# EAGLE design Diseño  (EAGLE 6.4)
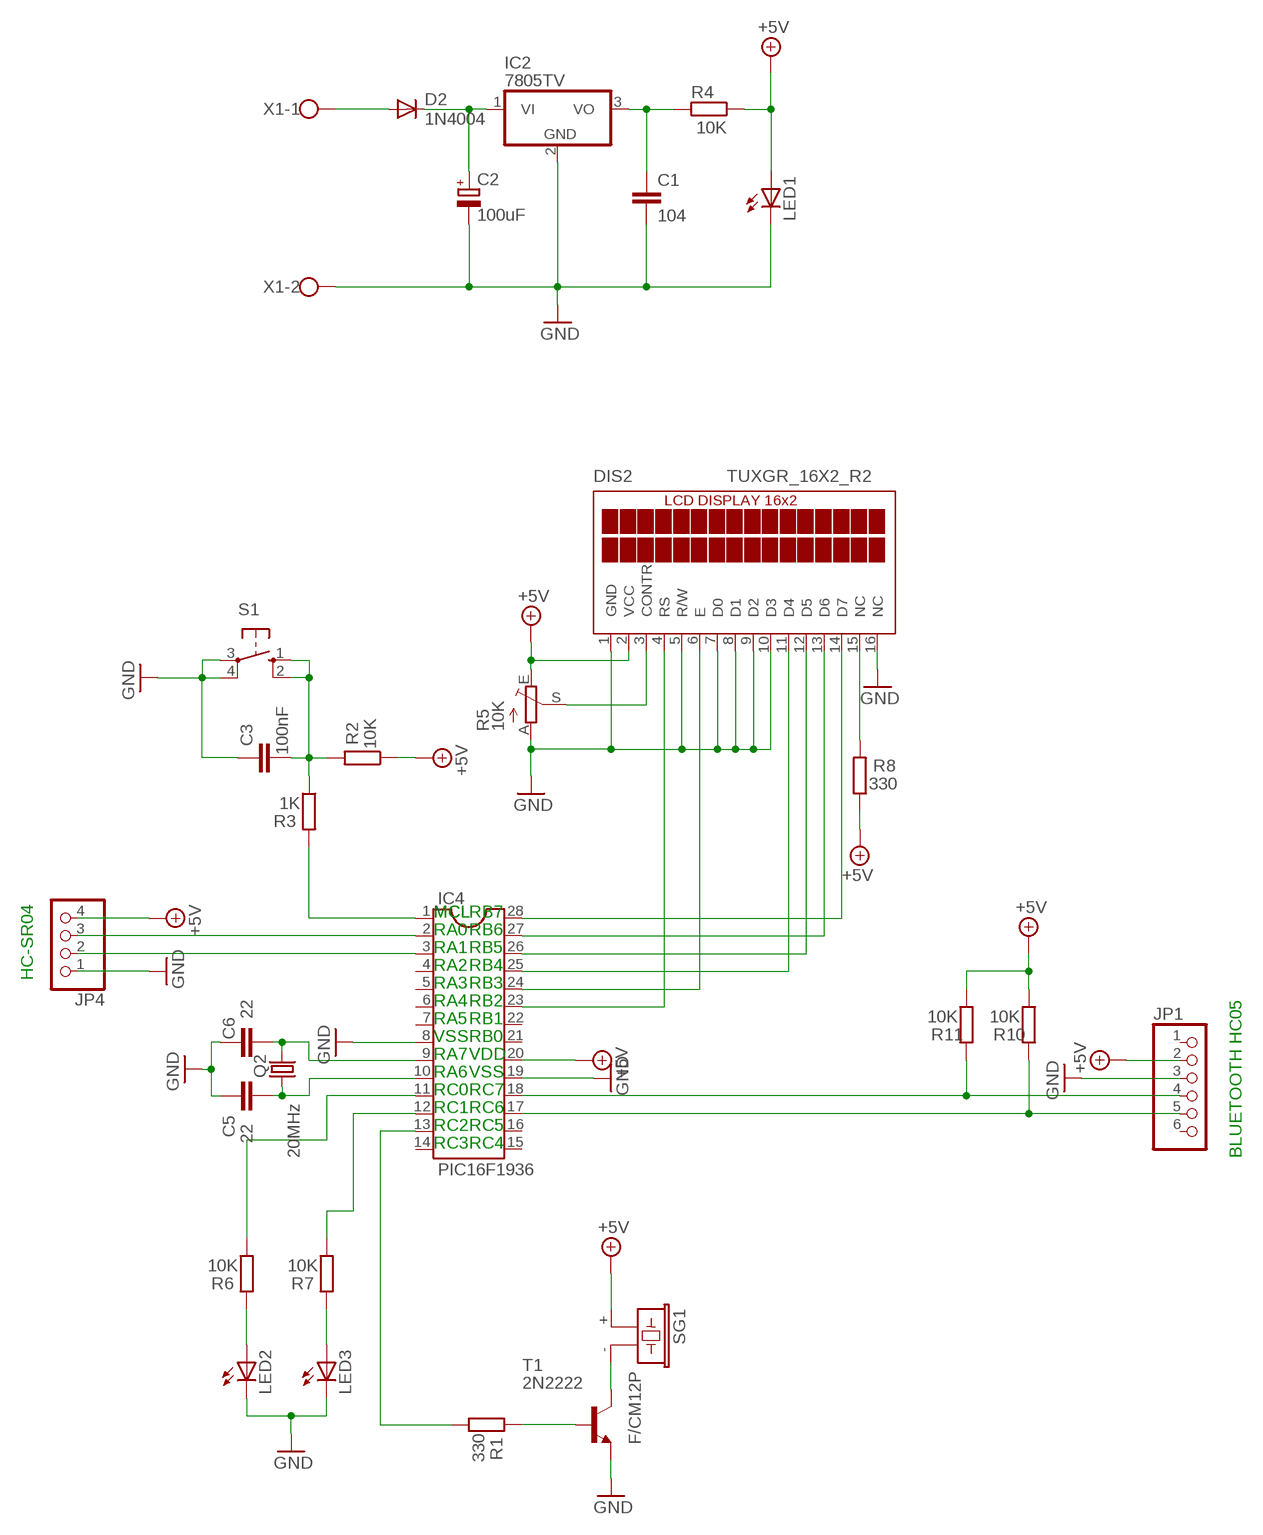
[diagram p0: schematic, sheet 1]

## Parts
C1  104  C-EU050-024X044  [C050-024X044]
C2  100uF  CPOL-EUE5-5  [E5-5]
C3  100nF  C-EU050-024X044  [C050-024X044]
C5  22  C-EU050-024X044  [C050-024X044]
C6  22  C-EU050-024X044  [C050-024X044]
D2  1N4004  [DO41-10]
DIS2  TUXGR_16X2_R2  [TUXGR_16X2_R2]
IC2  7805TV  [TO220V]
IC4  PIC16F1936  DIL28/3  [DIL28S]
JP1  PINHD-1X6  [1X06]
JP4  PINHD-1X4  [1X04]
LED1  LED3MM  [LED3MM]
LED2  LED3MM  [LED3MM]
LED3  LED3MM  [LED3MM]
Q2  20MHz  CRYSTALHC49U-V  [HC49U-V]
R1  330  R-EU_0207/10  [0207/10]
R2  10K  R-EU_0207/10  [0207/10]
R3  1K  R-EU_0207/10  [0207/10]
R4  10K  R-EU_0207/10  [0207/10]
R5  10K  TRIM_EU-CA9V  [CA9V]
R6  10K  R-EU_0207/10  [0207/10]
R7  10K  R-EU_0207/10  [0207/10]
R8  330  R-EU_0207/10  [0207/10]
R10  10K  R-EU_0207/10  [0207/10]
R11  10K  R-EU_0207/10  [0207/10]
S1  10-XX  [B3F-10XX]
SG1  F/CM12P  [F/CM12P]
T1  2N2222  2N2222-NPN-TO92-EBC  [TO92-EBC]
X1  W237-102  [W237-102]

## Nets
+5V: DIS2.2(VCC) IC4.20 JP1.2 JP4.4 LED1.A R2.1 R4.1 R5.E R8.1 R10.1 R11.1 SG1.+
GND: C1.2 C2.- C3.2 C5.2 C6.2 DIS2.1(GND) DIS2.5(R/W) DIS2.7(D0) DIS2.8(D1) DIS2.9(D2) DIS2.10(D3) DIS2.16(NC) IC2.2(GND) IC4.8 IC4.19 JP1.3 JP4.1 LED1.K(C) LED2.K(C) LED3.K(C) R5.A S1.3(P) S1.4(P1) T1.E X1.2
N$1: D2.A X1.1
N$2: IC4.1 R3.2
N$3: R1.2 T1.B
N$4: SG1.- T1.C
N$5: C3.1 R2.2 R3.1 S1.1(S) S1.2(S1)
N$6: IC4.13 R1.1
N$7: IC4.2 JP4.3
N$8: DIS2.15(NC) R8.2
N$9: IC4.18 JP1.4 R11.2
N$10: IC4.17 JP1.5 R10.2
N$11: DIS2.11(D4) IC4.25
N$12: DIS2.12(D5) IC4.26
N$13: IC4.3 JP4.2
N$14: LED2.A R6.2
N$15: DIS2.13(D6) IC4.27
N$16: DIS2.14(D7) IC4.28
N$17: DIS2.6(E) IC4.24
N$18: C5.1 IC4.10 Q2.1
N$19: C6.1 IC4.9 Q2.2
N$20: DIS2.4(RS) IC4.23
N$21: C2.+ D2.C IC2.1(VI)
N$22: C1.1 IC2.3(VO) R4.2
N$24: LED3.A R7.2
N$26: IC4.11 R6.1
N$27: IC4.12 R7.1
N$51: DIS2.3(CONTR) R5.S
Unconnected: IC4.4 IC4.5 IC4.6 IC4.7 IC4.14 IC4.15 IC4.16 IC4.21 IC4.22 JP1.1 JP1.6

## Notes on the sheet
- MCL | MCL | RB7
- RA0 | RB6
- RA1 | RB5
- RA2 | RB4
- HC-SR04
- RA3 | RB3
- RA4 | RB2
- RA5 | RB1
- VSS | RB0
- RA7 | VDD
- RA6 | VSS
- RC0 | RC7
- RC1 | RC6
- RC2 | RC5
- RC3 | RC4
- BLUETOOTH HC05

## Library data of the parts
C1 C3 C5 C6 = rcl:C-EU: CAPACITOR, European symbol
C2 = rcl:CPOL-EU: POLARIZED CAPACITOR, European symbol
D2 = diode:1N4004: DIODE general purpose rectifier, 1 A
DIS2 = display-lcd:TUXGR_16X2_R2: Tuxgraphics LCD display 16x2 characters reflective, without background light Source: tuxgr_12x2_r2.pdf
IC2 = linear:78*: Positive VOLTAGE REGULATOR Source: http://cache.national.com/ds/LM/LM78L05.pdf http://www.fairchildsemi.com/ds/LM/LM7805.pdf
IC4 = dil:DIL28: SOCKET DIL28
JP1 = pinhead:PINHD-1X6: PIN HEADER
JP4 = pinhead:PINHD-1X4: PIN HEADER
LED1-LED3 = led:LED: LED OSRAM: - CHIPLED LG R971, LG N971, LY N971, LG Q971, LY Q971, LO R971, LY R971 LH N974, LH R974 LS Q976, LO Q976, LY Q976 LO Q996 - Hyper CHIPLED LW Q18S LB Q993, LB Q99A, LB R99A - SideLED LS A670, LO A670, LY A670, LG A670, LP A670 LB A673, LV A673, LT A673, LW A673 LH A674 LY A675 LS A676, LA A676, LO A676, LY A676, LW A676 LS A679, LY A679, LG A679 - Hyper Micro SIDELED® LS Y876, LA Y876, LO Y876, LY Y876 LT Y87S - SmartLED LW L88C, LW L88S LB L89C, LB L89S, LG L890 LS L89K, LO L89K, LY L89K LS L896, LA L896, LO L896, LY L896 - TOPLED LS T670, LO T670, LY T670, LG T670, LP T670 LSG T670, LSP T670, LSY T670, LOP T670, LYG T670 LG T671, LOG T671, LSG T671 LB T673, LV T673, LT T673, LW T673 LH T674 LS T676, LA T676, LO T676, LY T676, LB T676, LH T676, LSB T676, LW T676 LB T67C, LV T67C, LT T67C, LS T67K, LO T67K, LY T67K, LW E67C LS E67B, LA E67B, LO E67B, LY E67B, LB E67C, LV E67C, LT E67C LW T67C LS T679, LY T679, LG T679 LS T770, LO T770, LY T770, LG T770, LP T770 LB T773, LV T773, LT T773, LW T773 LH T774 LS E675, LA E675, LY E675, LS T675 LS T776, LA T776, LO T776, LY T776, LB T776 LHGB T686 LT T68C, LB T68C - Hyper Mini TOPLED® LB M676 - Mini TOPLED Santana® LG M470 LS M47K, LO M47K, LY M47K Source: http://www.osram.convergy.de - LUMILED® LXK2-PW12-R00, LXK2-PW12-S00, LXK2-PW14-U00, LXK2-PW14-V00 LXK2-PM12-R00, LXK2-PM12-S00, LXK2-PM14-U00 LXK2-PE12-Q00, LXK2-PE12-R00, LXK2-PE12-S00, LXK2-PE14-T00, LXK2-PE14-U00 LXK2-PB12-K00, LXK2-PB12-L00, LXK2-PB12-M00, LXK2-PB14-N00, LXK2-PB14-P00, LXK2-PB14-Q00 LXK2-PR12-L00, LXK2-PR12-M00, LXK2-PR14-Q00, LXK2-PR14-R00 LXK2-PD12-Q00, LXK2-PD12-R00, LXK2-PD12-S00 LXK2-PH12-R00, LXK2-PH12-S00 LXK2-PL12-P00, LXK2-PL12-Q00, LXK2-PL12-R00 Source: www.luxeon.com
Q2 = crystal:CRYSTAL: CRYSTAL
R1-R4 R6-R8 R10 R11 = rcl:R-EU_: RESISTOR, European symbol
R5 = pot:TRIM_EU-: POTENTIOMETER
S1 = switch-omron:10-XX: OMRON SWITCH
SG1 = buzzer:F/CM12P: BUZZER Source: Buerklin
T1 = transistor-neu-to92:*-NPN-: NPN Transistror
X1 = con-wago-500:W237-102: WAGO SCREW CLAMP

## Board
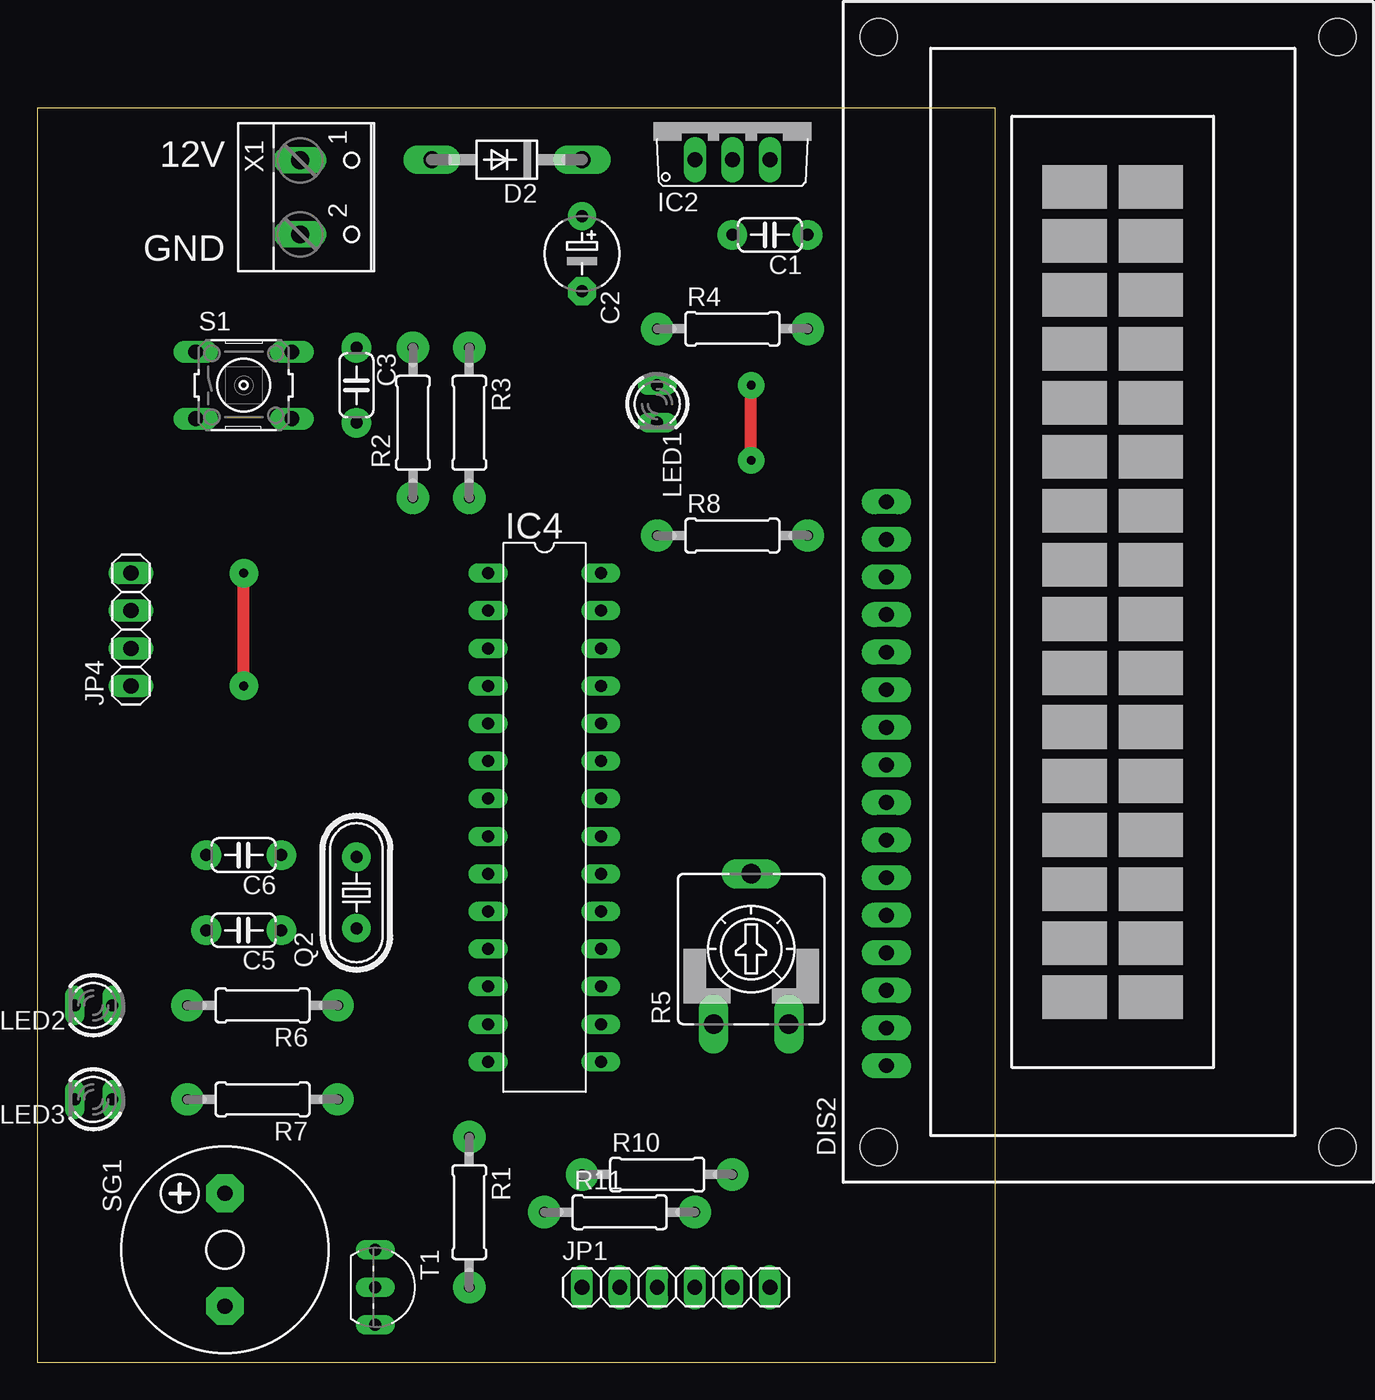
[diagram p1: board, top side]
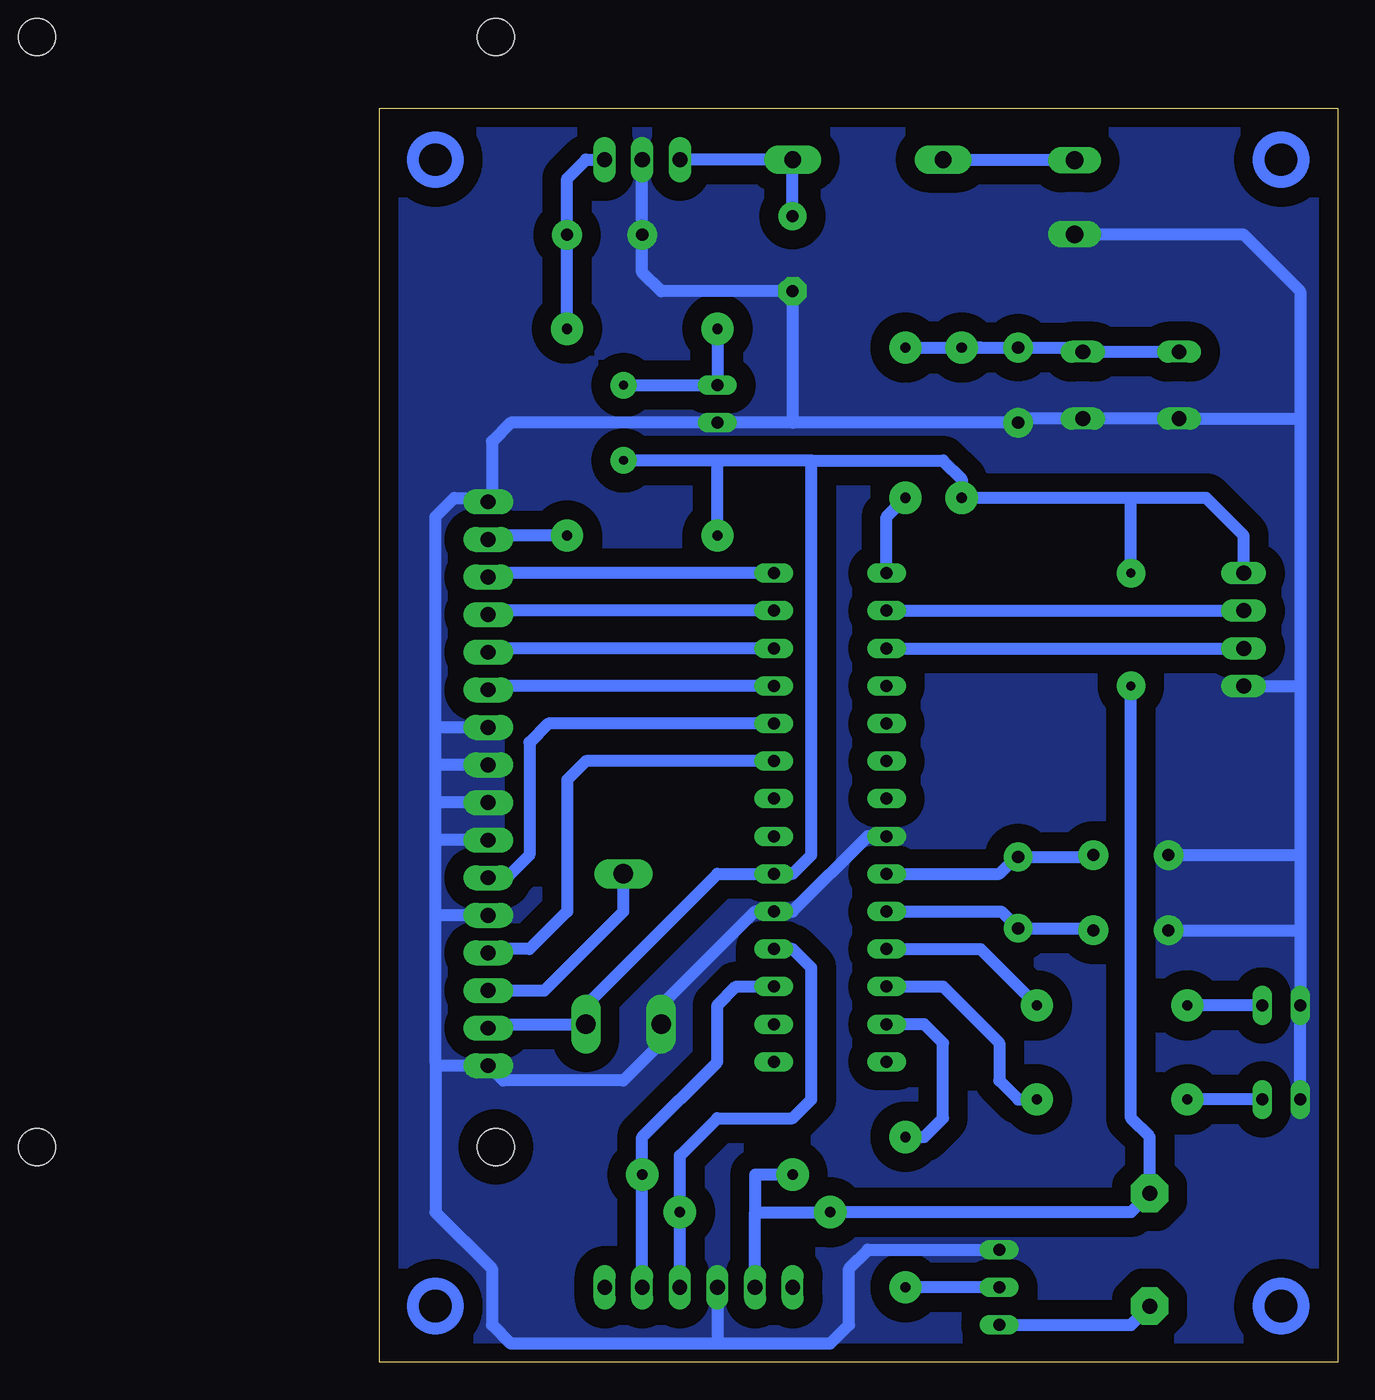
[diagram p2: board, bottom side, seen from below]

Size 64.75 x 84.76 mm. Coordinates in mm from the lower left corner, seen from the top.
Outline: 0,0 64.75,0 64.75,84.76 0,84.76 0,0
Copper layers (1*16): Top 0.035mm / dielectric 1.5mm / Bottom 0.035mm
Design rules "default": minimum track width 10mil, minimum drill 24mil, track to track 8mil, track to pad 8mil, pad to pad 8mil, via to via 8mil, smd to smd 8mil, copper to edge 40mil, drill to drill 8mil, minimum pad ring 10mil, minimum via ring 8mil, stop-mask expansion 4mil, vias tented up to drill 0mil, thermal gap 10mil

### Footprints (pad centres in the part's own frame; a part is rotated, then mirrored left to right if it is on the bottom)
C050-024X044 = drill 0.813 pad 2.007: 1 -2.54,0; 2 2.54,0
E5-5 = drill 0.813 pad 1.905: + -2.54,0 | drill 0.813 pad 1.905 octagon: - 2.54,0
DO41-10 = drill 1.118 pad 1.93 long: A 5.08,0; C -5.08,0
TUXGR_16X2_R2 = drill 1 pad 1.676 long: 1 -32.01,14.99; 2 -29.47,14.99; 3 -26.93,14.99; 4 -24.39,14.99; 5 -21.85,14.99; 6 -19.31,14.99; 7 -16.77,14.99; 8 -14.23,14.99; 9 -11.69,14.99; 10 -9.15,14.99; 11 -6.61,14.99; 12 -4.07,14.99; 13 -1.53,14.99; 14 1.01,14.99; 15 3.55,14.99; 16 6.09,14.99 | hole 2.5: -37.5,-15.5; 37.5,-15.5; -37.5,15.5; 37.5,15.5
TO220V = drill 1.016 long: 1 -2.54,-2.54; 2 0,-2.54; 3 2.54,-2.54
DIL28S = drill 0.813 long: 1 -16.51,-3.81; 2 -13.97,-3.81; 3 -11.43,-3.81; 4 -8.89,-3.81; 5 -6.35,-3.81; 6 -3.81,-3.81; 7 -1.27,-3.81; 8 1.27,-3.81; 9 3.81,-3.81; 10 6.35,-3.81; 11 8.89,-3.81; 12 11.43,-3.81; 13 13.97,-3.81; 14 16.51,-3.81; 15 16.51,3.81; 16 13.97,3.81; 17 11.43,3.81; 18 8.89,3.81; 19 6.35,3.81; 20 3.81,3.81; 21 1.27,3.81; 22 -1.27,3.81; 23 -3.81,3.81; 24 -6.35,3.81; 25 -8.89,3.81; 26 -11.43,3.81; 27 -13.97,3.81; 28 -16.51,3.81
1X06 = drill 0.991 long: 1 -6.35,0; 2 -3.81,0; 3 -1.27,0; 4 1.27,0; 5 3.81,0; 6 6.35,0
1X04 = drill 1.016 long: 1 -3.81,0; 2 -1.27,0; 3 1.27,0; 4 3.81,0
LED3MM = drill 0.813 long: A -1.27,0; K 1.27,0
HC49U-V = drill 0.813 pad 1.93: 1 -2.413,0; 2 2.413,0
0207/10 = drill 0.7 pad 2.184: 1 -5.08,0; 2 5.08,0
CA9V = drill 1.321 long: A -2.54,-5.08; E 2.54,-5.08; S 0,5.08
B3F-10XX = drill 0.991 long: 1 -3.251,2.261; 2 3.251,2.261; 3 -3.251,-2.261; 4 3.251,-2.261
F/CM12P = drill 1.016 pad 2.54 octagon: + 3.81,0; - -3.81,0
TO92-EBC = drill 0.813 long: B 0,-1.27; C 2.54,-1.27; E -2.54,-1.27
W237-102 = drill 1.194 long: 1 -2.5,-1.27; 2 2.5,-1.27

### Placement (x,y rotation side)
C1  49.53,76.2 180 top
C2  36.83,74.93 270 top
C3  21.59,66.04 270 top
C5  13.97,29.21 180 top
C6  13.97,34.29 180 top
D2  31.75,81.28 180 top
DIS2  72.39,52.07 90 top
IC2  46.99,83.82 0 top
IC4  34.29,36.83 270 top
JP1  43.18,5.08 0 top
JP4  6.35,49.53 90 top
LED1  41.91,64.77 270 top
LED2  3.81,24.13 180 top
LED3  3.81,17.78 180 top
Q2  21.59,31.75 90 top
R1  29.21,10.16 270 top
R2  25.4,63.5 90 top
R3  29.21,63.5 270 top
R4  46.99,69.85 0 top
R5  48.26,27.94 0 top
R6  15.24,24.13 180 top
R7  15.24,17.78 180 top
R8  46.99,55.88 0 top
R10  41.91,12.7 0 top
R11  39.37,10.16 0 top
S1  13.97,66.04 0 top
SG1  12.7,7.62 90 top
T1  24.13,5.08 270 top
X1  19.05,78.74 270 top

### Tracks (layer width: path | path; a pad name or v marks a point on that pad's centre or on a via)
+5V  (via drill 0.6 pad 1.78, 0.6 pad 1.93)
  Top 0.813: v13.97,45.72 v13.97,53.34 | v48.26,60.96 v48.26,66.04
  Bottom 0.813: JP4.4 6.35,55.88 8.89,58.42 13.97,58.42 | 13.97,58.42 R2.1 25.4,59.69 26.67,60.96 35.56,60.96 | DIS2.2 57.14,22.86 R5.E 50.8,24.13 41.91,33.02 IC4.20 36.83,33.02 35.56,34.29 35.56,60.96 | R8.1 41.91,60.96 | JP1.2 39.37,10.16 | R10.1 39.37,12.7 39.37,10.16 | 39.37,10.16 R11.1 13.97,10.16 SG1.+ 12.7,15.24 13.97,16.51 v13.97,45.72 | v13.97,53.34 13.97,58.42 | R4.1 LED1.A v48.26,66.04 | 35.56,60.96 41.91,60.96 | 41.91,60.96 v48.26,60.96
GND
  Bottom 0.813: IC2.2 C1.2 46.99,73.66 45.72,72.39 C2.- 36.83,63.5 | 36.83,63.5 C3.2 21.31,63.78 S1.4 S1.3 2.82,63.78 2.54,63.5 | X1.2 6.39,76.24 2.54,72.39 2.54,63.5 | 2.54,63.5 2.54,45.72 | 2.54,45.72 2.54,34.29 | 2.54,34.29 2.54,29.21 | 2.54,29.21 LED2.K LED3.K | C5.2 2.54,29.21 | C6.2 2.54,34.29 | JP4.1 2.54,45.72 | 60.96,20.32 60.96,30.48 | 60.96,30.48 60.96,35.56 | 60.96,35.56 60.96,38.1 | 60.96,38.1 60.96,40.64 | 60.96,40.64 60.96,43.18 | 60.96,43.18 60.96,57.15 59.69,58.42 57.66,58.42 DIS2.16 57.15,58.41 57.15,62.23 55.88,63.5 LED1.K 36.83,63.5 | DIS2.9 60.7,40.38 60.96,40.64 | DIS2.10 60.7,42.92 60.96,43.18 | DIS2.8 60.7,37.84 60.96,38.1 | DIS2.7 60.7,35.3 60.96,35.56 | DIS2.5 60.7,30.22 60.96,30.48 | 60.96,20.32 60.7,20.06 DIS2.1 56.39,19.05 48.26,19.05 45.72,21.59 R5.A 45.72,24.13 39.37,30.48 IC4.19 36.83,30.48 31.75,35.56 IC4.8 | 41.91,1.27 34.29,1.27 33.02,2.54 33.02,6.35 31.75,7.62 T1.E | 41.91,1.27 55.88,1.27 57.15,2.54 57.15,6.35 60.96,10.16 60.96,20.32 | JP1.3 41.91,1.27
  pour Bottom (isolate 1.27, no thermals): 0,85.09 64.77,85.09 64.77,0 0,0
N$1
  Bottom 0.813: D2.A 17.78,81.28 X1.1
N$2
  Bottom 0.813: IC4.1 30.48,57.15 R3.2
N$3
  Bottom 0.813: T1.B R1.2
N$4
  Bottom 0.813: T1.C 13.97,2.54 SG1.-
N$5
  Bottom 0.813: R3.1 R2.2 | 24.13,68.58 R2.2 | R2.2 C3.1 16.94,68.58 | S1.1 S1.2 16.94,68.58 | 16.51,68.58 16.94,68.58
N$6
  Bottom 0.813: R1.1 27.94,15.24 26.67,16.51 26.67,21.59 27.94,22.86 IC4.13
N$7
  Bottom 0.813: IC4.2 JP4.3
N$8
  Bottom 0.813: R8.2 57.14,55.88 DIS2.15
N$9
  Bottom 0.813: JP1.4 R11.2 44.45,13.97 41.91,16.51 36.83,16.51 35.56,17.78 35.56,26.67 36.83,27.94 IC4.18
N$10
  Bottom 0.813: JP1.5 R10.2 46.99,15.24 41.91,20.32 41.91,24.13 40.64,25.4 IC4.17
N$11
  Bottom 0.813: IC4.25 57.14,45.72 DIS2.11
N$12
  Bottom 0.813: IC4.26 57.14,48.26 DIS2.12
N$13
  Bottom 0.813: IC4.3 JP4.2
N$14
  Bottom 0.813: LED2.A R6.2
N$15
  Bottom 0.813: IC4.27 57.14,50.8 DIS2.13
N$16
  Bottom 0.813: IC4.28 57.14,53.34 DIS2.14
N$17
  Bottom 0.813: IC4.24 53.34,43.18 54.61,41.91 54.61,34.29 55.88,33.02 57.15,33.02 | 57.15,33.02 58.42,33.02 | DIS2.6 57.15,33.02
N$18
  Bottom 0.813: IC4.10 22.73,30.48 Q2.1 16.64,29.34 C5.1
N$19
  Bottom 0.813: IC4.9 22.86,33.02 21.59,34.29 Q2.2 16.64,34.16 C6.1
N$20
  Bottom 0.813: IC4.23 50.8,40.64 52.07,39.37 52.07,30.48 54.61,27.94 57.14,27.94 DIS2.4
N$21
  Bottom 0.813: IC2.1 D2.C C2.+
N$22
  Bottom 0.813: R4.2 C1.1 52.07,80.01 50.8,81.28 IC2.3
N$24
  Bottom 0.813: LED3.A R7.2
N$26
  Bottom 0.813: IC4.11 24.13,27.94 R6.1
N$27
  Bottom 0.813: IC4.12 26.67,25.4 22.86,21.59 22.86,19.05 21.59,17.78 R7.1
N$51
  Bottom 0.813: DIS2.3 53.6,25.14 48.26,30.48 R5.S
(copper drawn outside any net)
  shapes: Bottom circle x4

### Text on the board
tPlace: 12V | GND | HC-SR04 | BLUETOOTH HC05